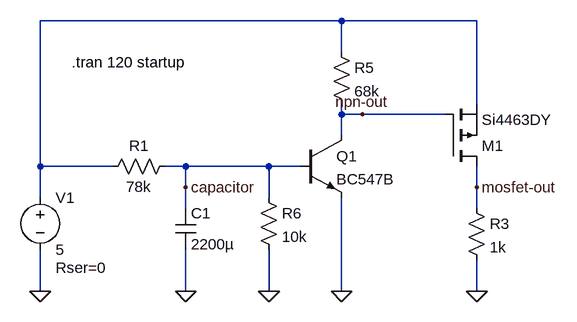
[diagram p0: schematic usb_power_delayer.asc]
usb_power_delayer.asc, the LTspice schematic file:
Version 4
SHEET 1 1000 680
WIRE 512 -144 48 -144
WIRE 720 -144 512 -144
WIRE 512 -96 512 -144
WIRE 720 -16 720 -144
WIRE 512 0 512 -16
WIRE 544 0 512 0
WIRE 672 0 544 0
WIRE 512 32 512 0
WIRE 48 80 48 -144
WIRE 160 80 48 80
WIRE 272 80 240 80
WIRE 400 80 272 80
WIRE 448 80 400 80
WIRE 272 112 272 80
WIRE 720 112 720 80
WIRE 48 128 48 80
WIRE 400 128 400 80
WIRE 272 144 272 112
WIRE 720 144 720 112
WIRE 48 272 48 208
WIRE 272 272 272 208
WIRE 400 272 400 208
WIRE 512 272 512 128
WIRE 720 272 720 224
FLAG 48 272 0
FLAG 272 272 0
FLAG 720 272 0
FLAG 512 272 0
FLAG 720 112 mosfet-out
FLAG 544 0 npn-out
FLAG 272 112 capacitor
FLAG 400 272 0
SYMBOL voltage 48 112 R0
WINDOW 123 0 0 Left 0
WINDOW 39 24 124 Left 2
SYMATTR SpiceLine Rser=0
SYMATTR InstName V1
SYMATTR Value 5
SYMBOL res 256 64 R90
WINDOW 0 0 56 VBottom 2
WINDOW 3 32 56 VTop 2
SYMATTR InstName R1
SYMATTR Value 78k
SYMBOL cap 256 144 R0
SYMATTR InstName C1
SYMATTR Value 2200µ
SYMBOL res 704 128 R0
SYMATTR InstName R3
SYMATTR Value 1k
SYMBOL pmos 672 80 M180
SYMATTR InstName M1
SYMATTR Value Si4463DY
SYMBOL npn 448 32 R0
SYMATTR InstName Q1
SYMATTR Value BC547B
SYMBOL res 496 -112 R0
SYMATTR InstName R5
SYMATTR Value 68k
SYMBOL res 384 112 R0
SYMATTR InstName R6
SYMATTR Value 10k
TEXT 96 -80 Left 2 !.tran 120 startup

The netlist it stands for:
* usb_power_delayer.asc
V1 N001 0 5 Rser=0
R1 capacitor N001 78k
C1 capacitor 0 2200µ
R3 mosfet-out 0 1k
M1 mosfet-out npn-out N001 N001 Si4463DY
Q1 npn-out capacitor 0 0 BC547B
R5 N001 npn-out 68k
R6 capacitor 0 10k
.model NPN NPN
.model PNP PNP
.lib standard.bjt
.model NMOS NMOS
.model PMOS PMOS
.lib standard.mos
.tran 120 startup
.backanno
.end

* Results of the author's LTspice run, read from the files saved beside the schematic
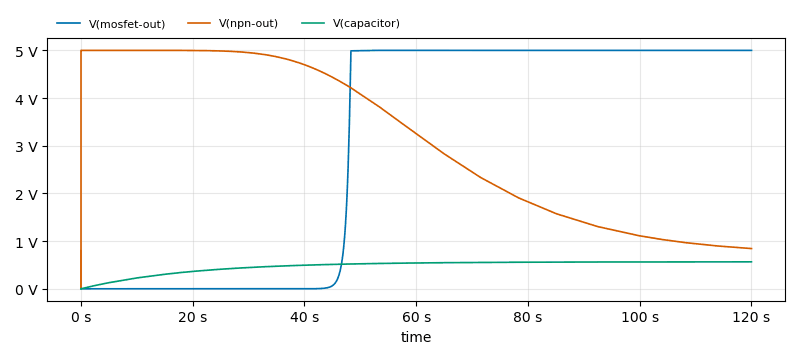
[diagram p1: Transient Analysis of usb_power_delayer.asc, plotted from the saved traces]
* Transient Analysis, 1 run:
*   V(mosfet-out): min -8.543 µV, max 5 V, average 3.018 V, rms 3.874 V, last 5 V
*   V(npn-out): min 0 V, max 5 V, average 3.137 V, rms 3.539 V, last 844 mV
*   V(capacitor): min 0 V, max 565.3 mV, average 475.2 mV, rms 493.7 mV, last 565.3 mV